# Altium schematic sheet IMU Sensor.SchDoc
size A4
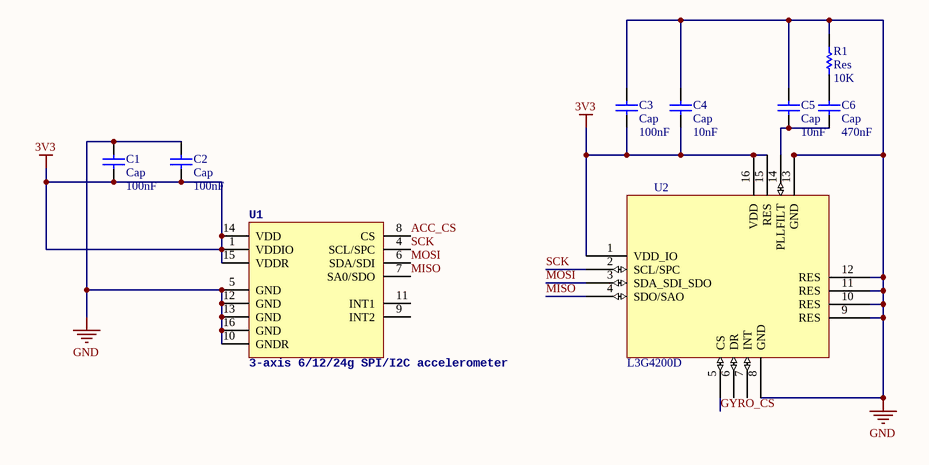
[diagram p0: IMU Sensor.SchDoc]

## Parts
C1  Cap  value 100nF  [0603-CAP]
C2  Cap  value 100nF  [0603-CAP]
C3  Cap  value 100nF  [0603-CAP]
C4  Cap  value 10nF  [0603-CAP]
C5  Cap  value 10nF  [0603-CAP]
C6  Cap  value 470nF  [0603-CAP]
R1  Res  value 10K  [0603-RES]
U1  3-axis 6/12/24g SPI/I2C accelerometer  [LGA16-3MM]
U2  L3G4200D  [L3G4200D]

## Nets
3V3: C1.1 C2.1 C3.1 C4.1 U1.1(VDDIO) U1.14(VDD) U1.15(VDDR) U2.1(VDD_IO) U2.15(RES) U2.16(VDD)
GND: C1.2 C2.2 C3.2 C4.2 C5.1 R1.2 U1.5(GND) U1.10(GNDR) U1.12(GND) U1.13(GND) U1.16(GND) U2.8(GND) U2.9(RES) U2.10(RES) U2.11(RES) U2.12(RES) U2.13(GND)
ACC_CS: U1.8(CS)
GYRO_CS: U2.5(CS)
MISO: U1.7(SA0/SDO) U2.4(SDO/SAO)
MOSI: U1.6(SDA/SDI) U2.3(SDA_SDI_SDO)
SCK: U1.4(SCL/SPC) U2.2(SCL/SPC)
NetC5_2: C5.2 C6.1 U2.14(PLLFILT)
NetC6_2: C6.2 R1.1

Not connected (* = marked no-connect by the designer): U1 9(INT2) 11(INT1); U2 6(DR) 7(INT)

## Library data of the parts
C1-C6 = Cap: Capacitor; Published: 8-Jun-2000; LatestRevisionDate: 17-Jul-2002; LatestRevisionNote: Re-released for DXP Platform.; PackageReference: RAD-0.3; Publisher: Altium Limited; PackageDescription: Radial Cap, Thru-Hole; 2 Leads; 0.3 in Pin Spacing
R1 = Res: Resistor; Published: 8-Jun-2000; LatestRevisionDate: 17-Jul-2002; LatestRevisionNote: Re-released for DXP Platform.; PackageReference: AXIAL-0.3; Publisher: Altium Limited; PackageDescription: Axial Device, Thru-Hole; 2 Leads; 0.3 in Pin Spacing
U1 = LIS331